# EasyEDA Pro project little_squeaky_machine.eprj, schematic Little Squeaky Machine

## Sheets
1 Processing: Board Name: Little_Squeaky_Machine_Hardware; Create Date: 2025-10-26; Page Name: Processing; Project Name: little_squeaky_machine; Schematic Name: Little Squeaky Machine; Update Date: 2025-10-26; Company: Hi Squeaky Things Lab; Drawn: Daniël; Page Size: A3; Reviewed: Daniël; Version: 0.1.0
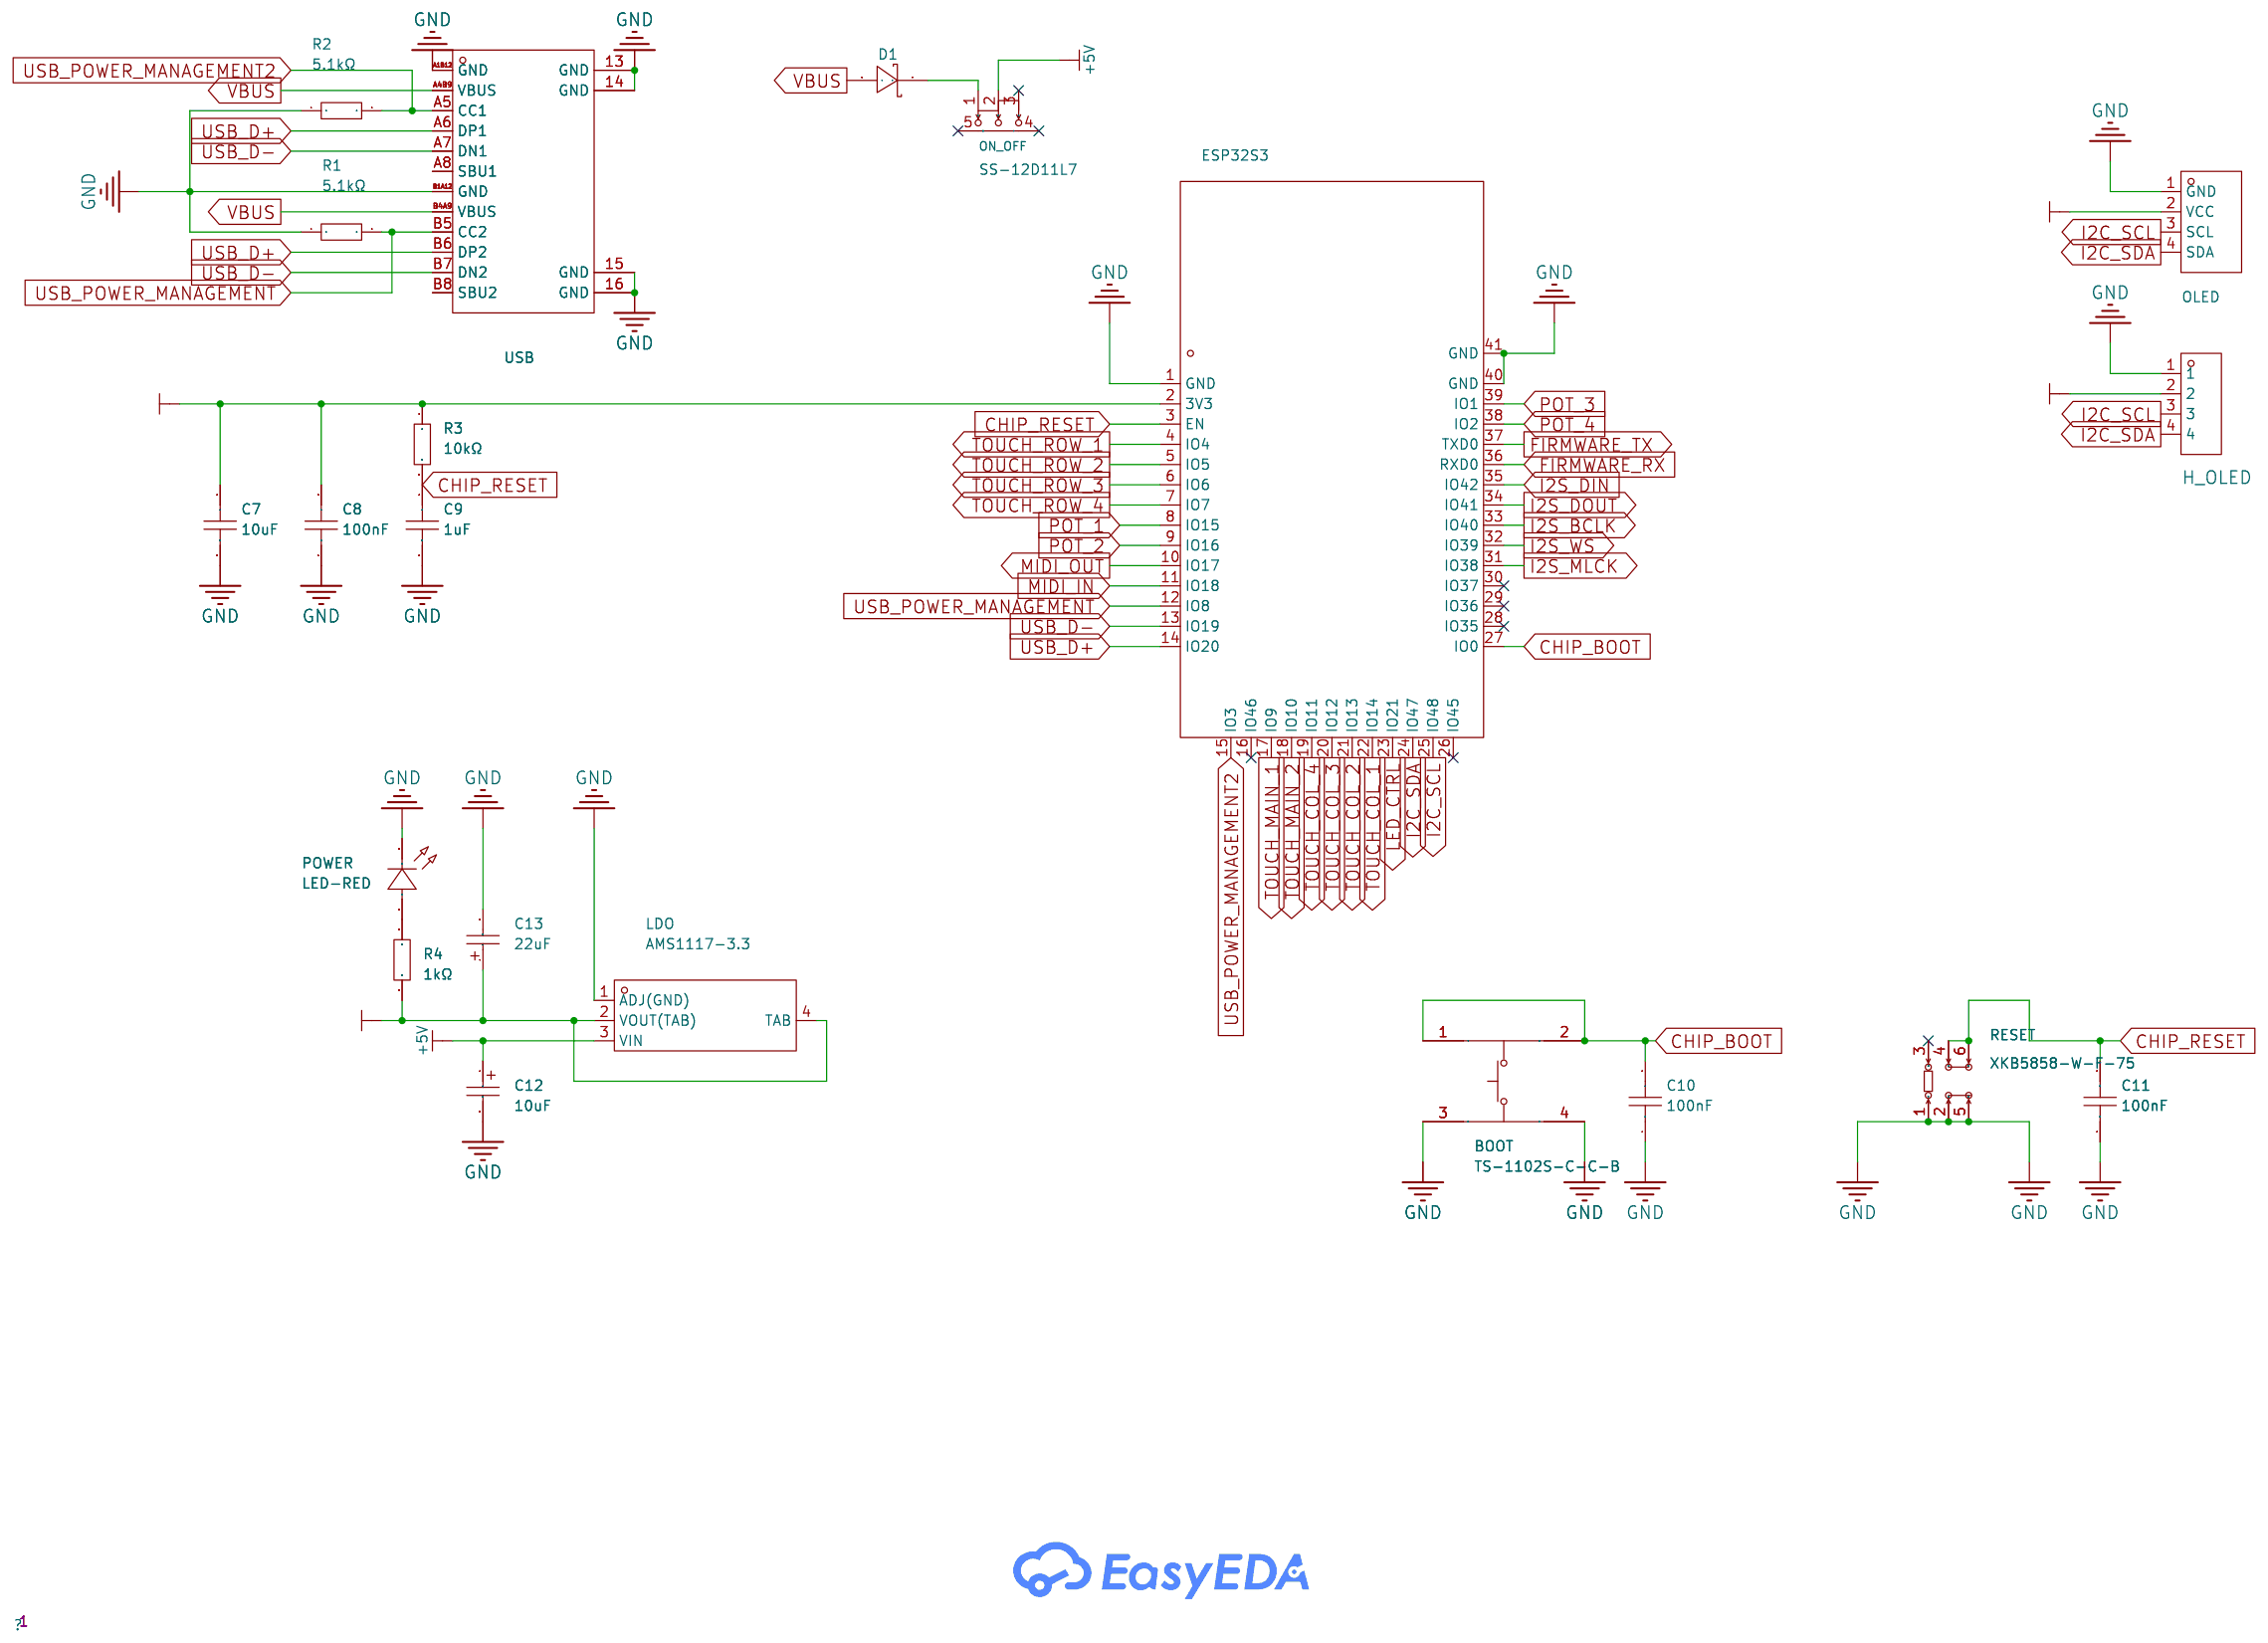
[diagram p0: Processing]
2 Audio Codec: Page Name: Audio Codec; Company: Hi Squeaky Things
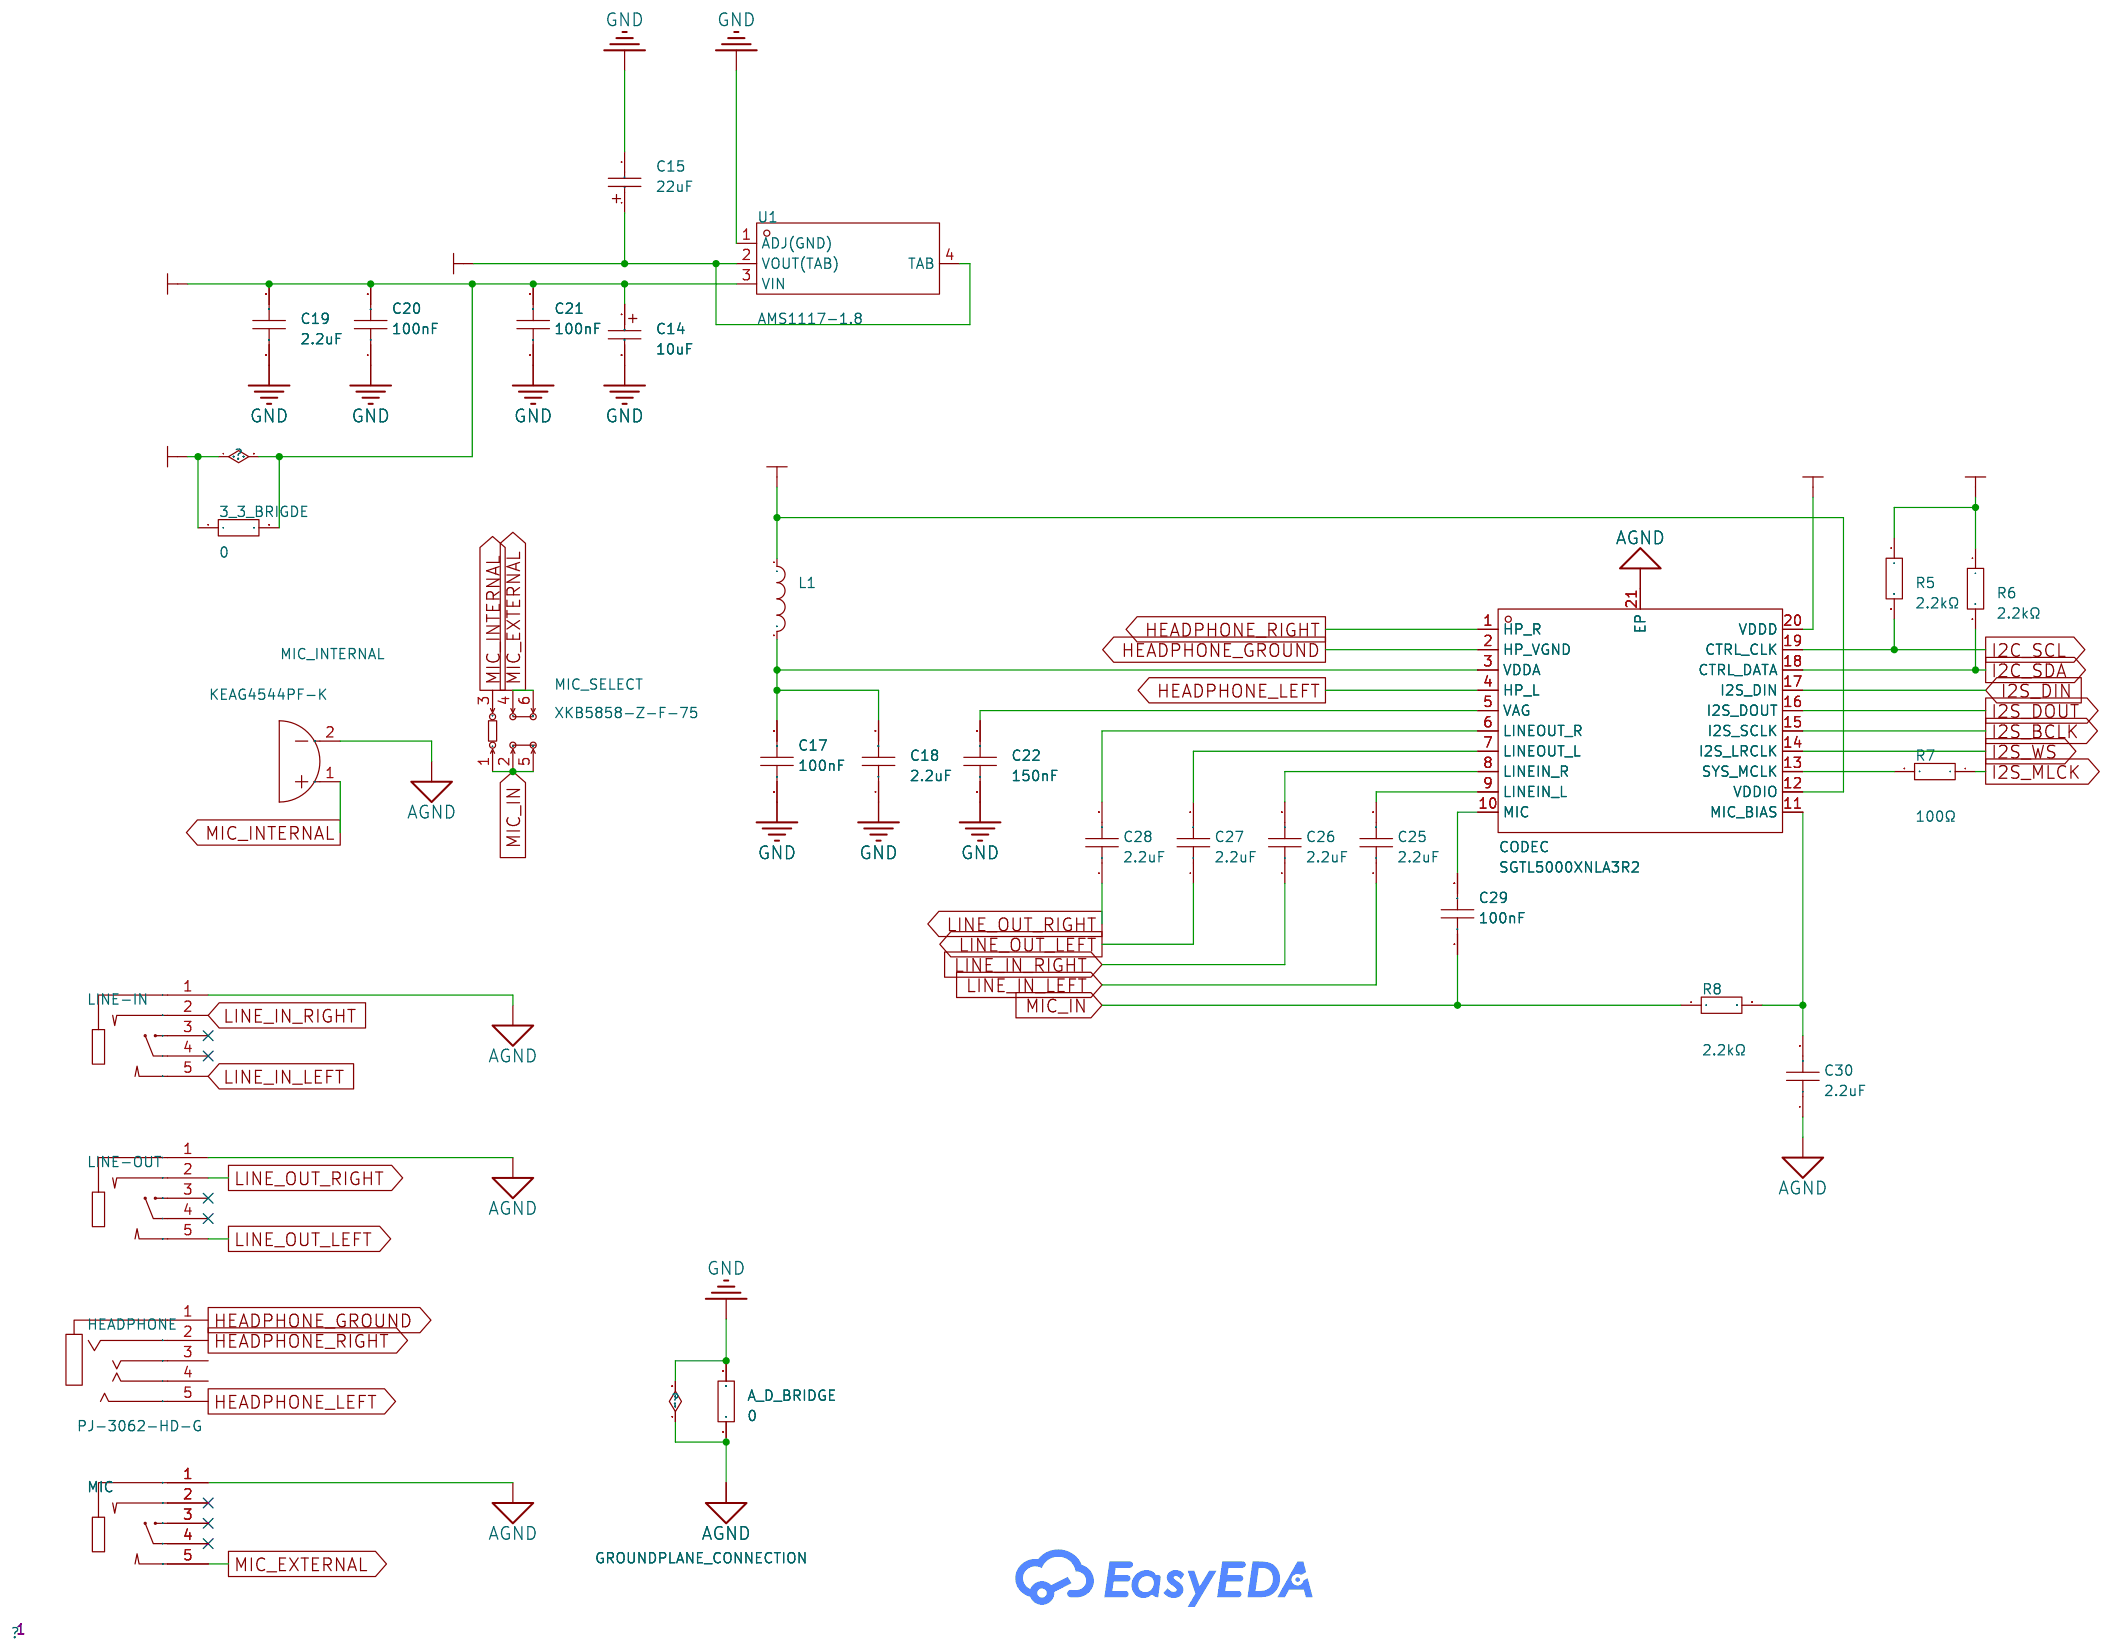
[diagram p1: Audio Codec]
3 Led Controls: Page Name: Led Controls; Company: Hi Squeaky Things; Drawn: Daniel; Page Size: A4
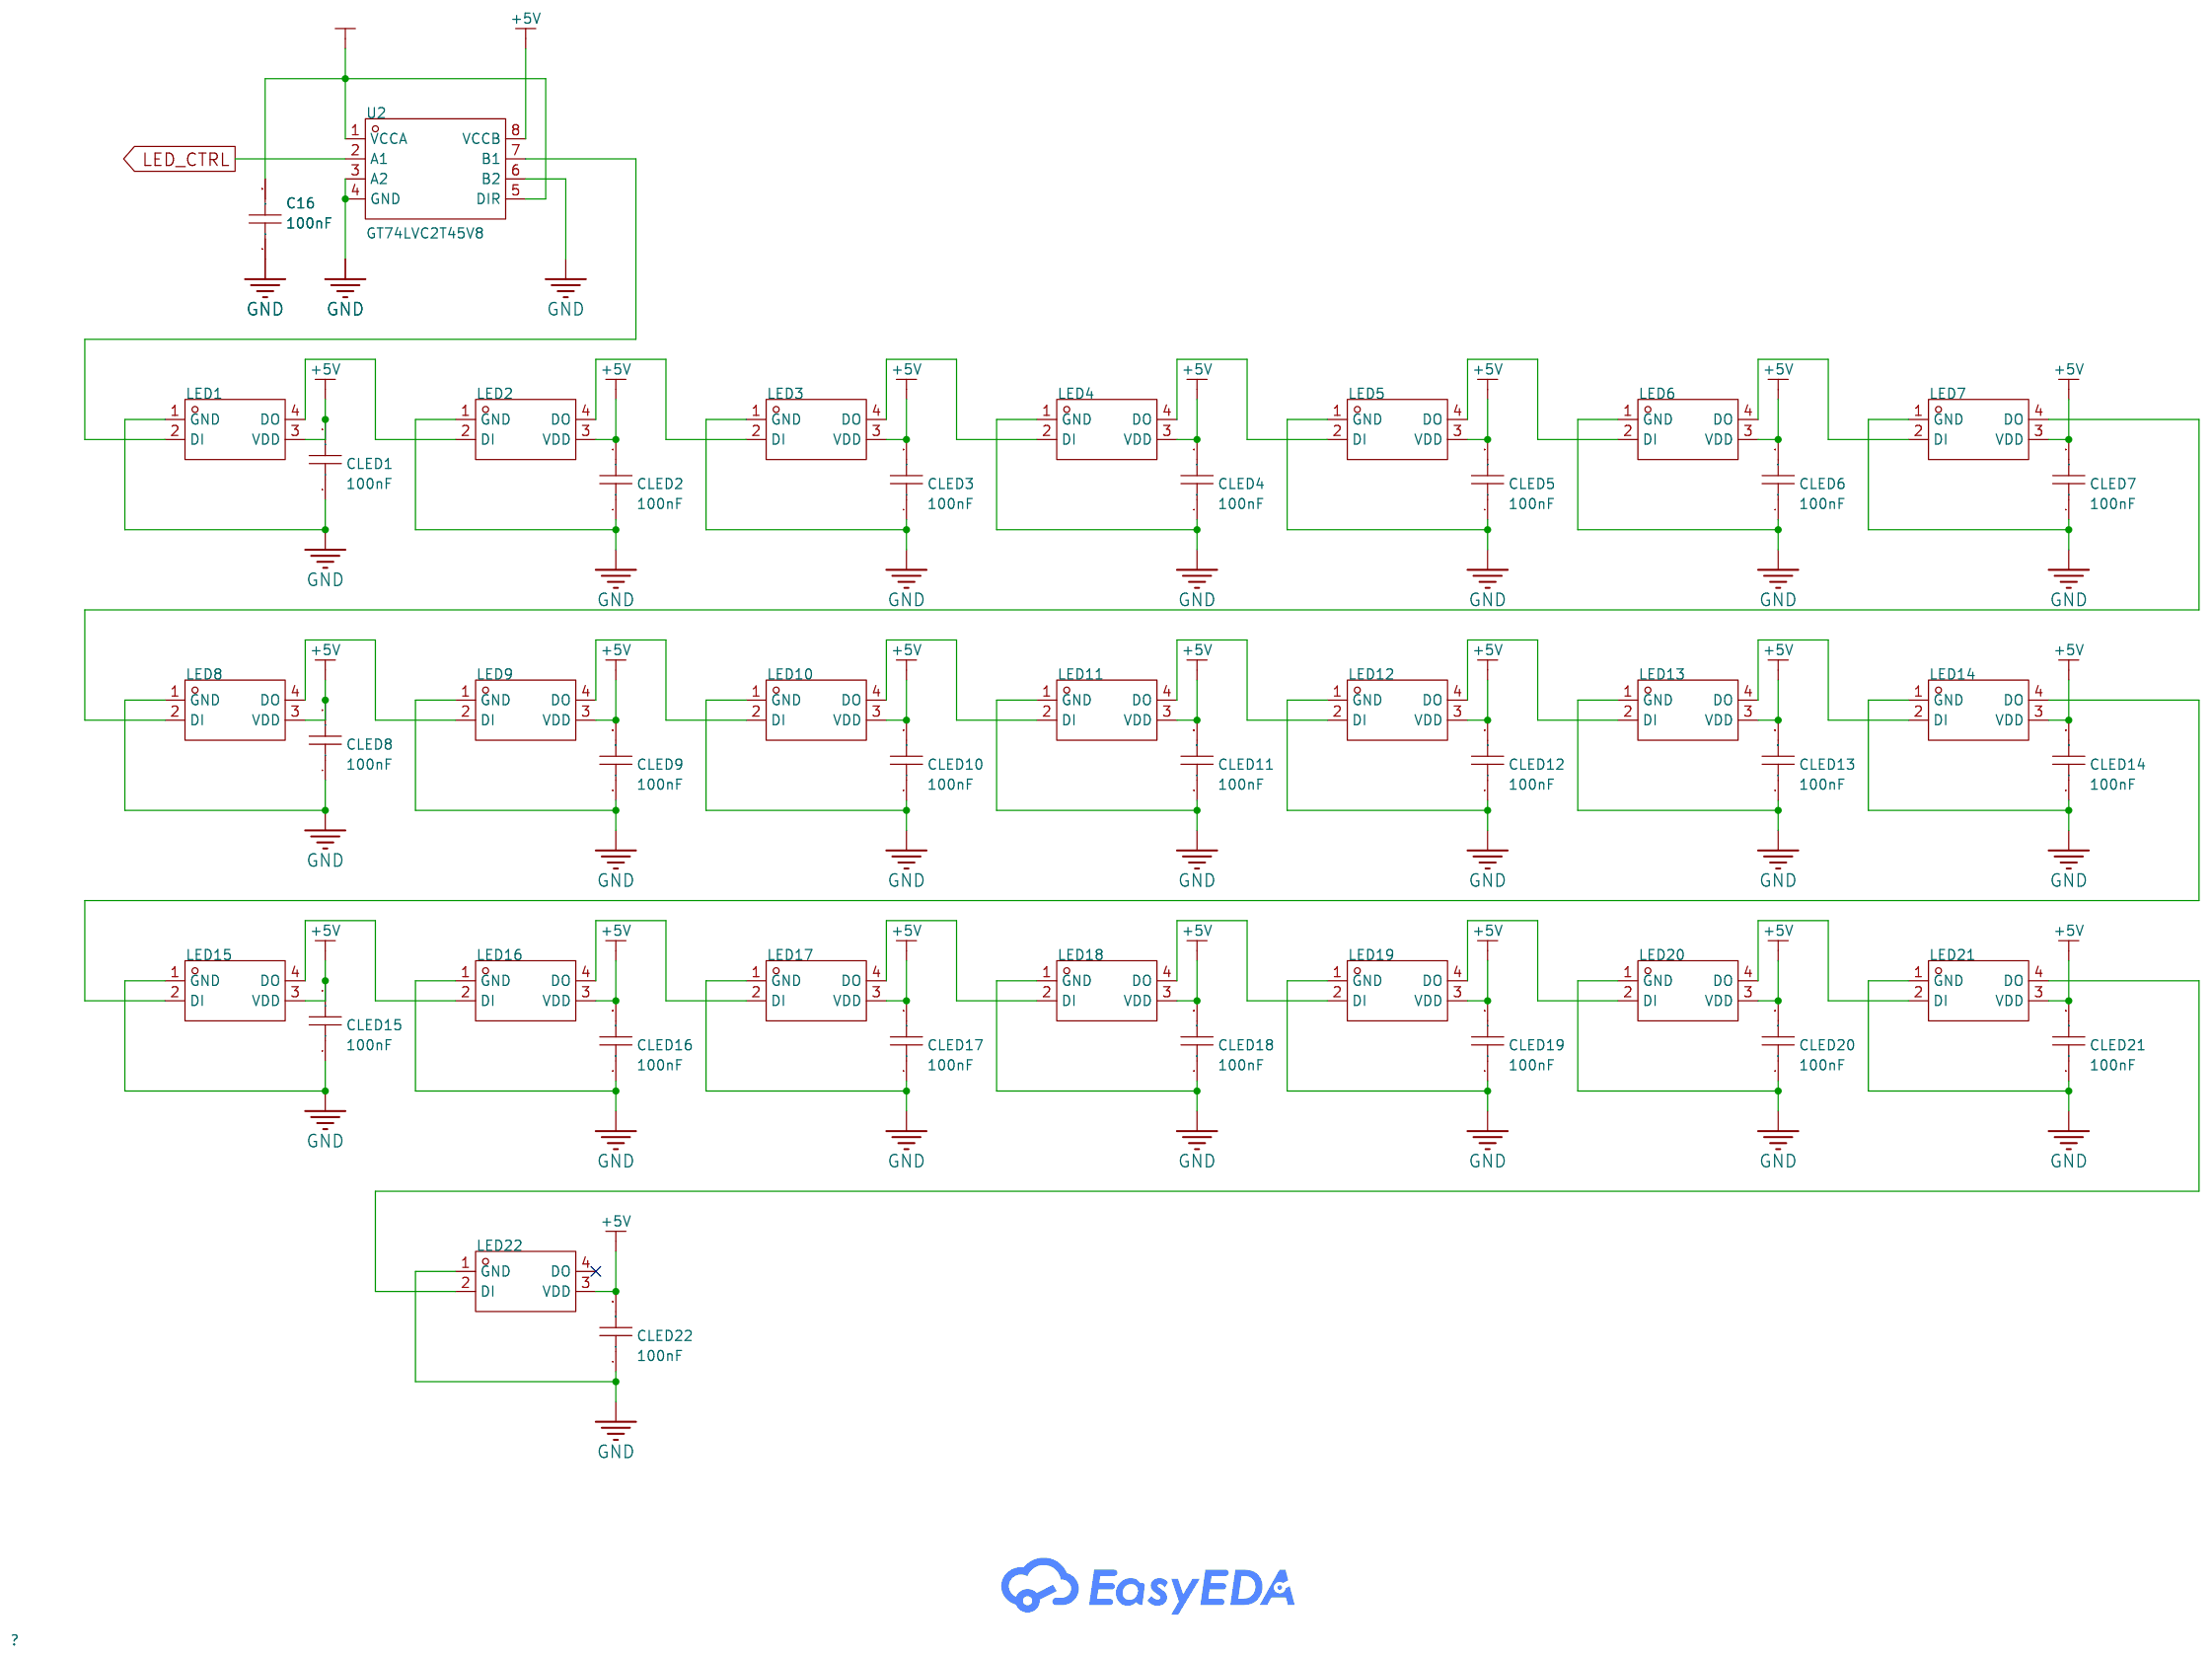
[diagram p2: Led Controls]
4 Pot and Encoder Controls: Page Name: Pot and Encoder Controls; Company: Hi Squeaky Things; Page Size: A4
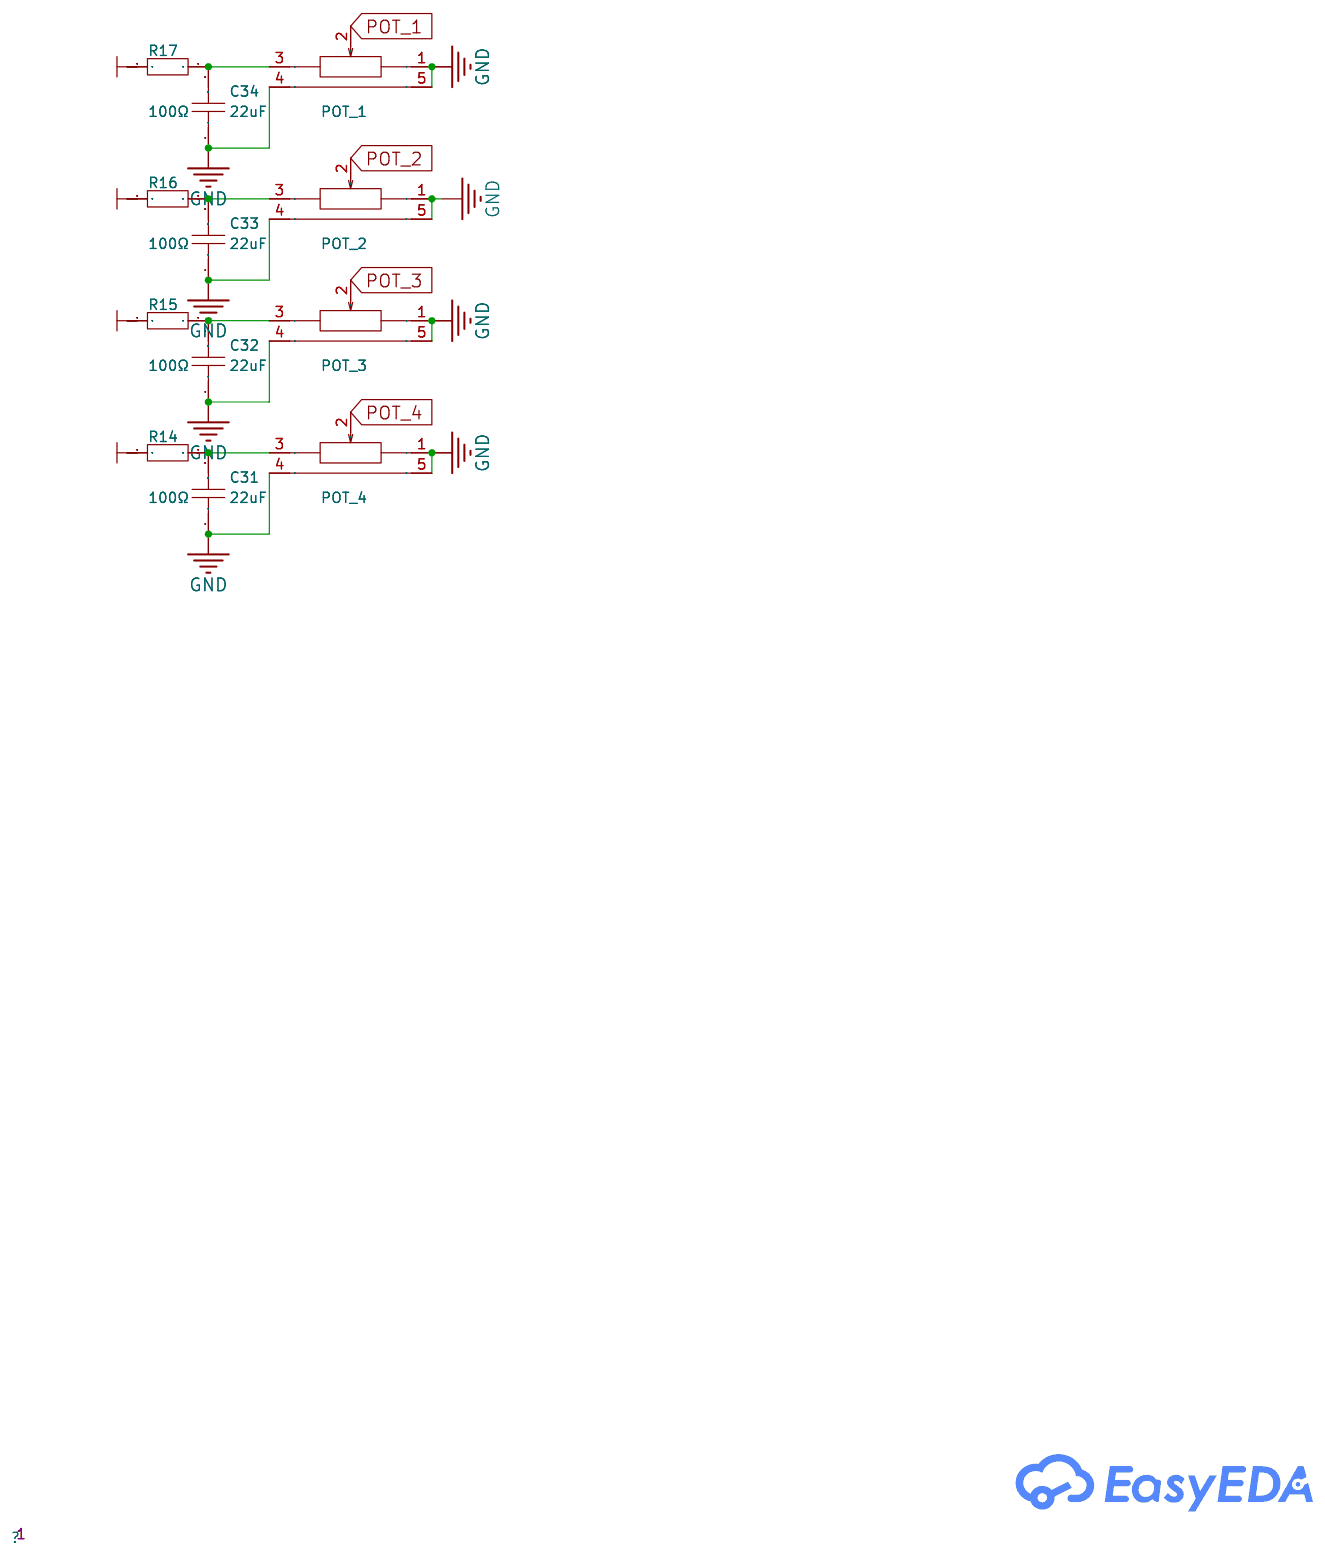
[diagram p3: Pot and Encoder Controls]

## Parts
sheet Audio Codec
3_3_BRIGDE  0  [R0603]  (no BOM)
A_D_BRIDGE  0  [R0603]  (no BOM)
C14  10uF  [CASE-A_3216]
C15  22uF  [CASE-A_3216]
C17  100nF  [C0402]
C18  2.2uF  [C0402]
C19  2.2uF  [C0402]
C20  100nF  [C0402]
C21  100nF  [C0402]
C22  150nF  [C0402]
C25  2.2uF  [C0402]
C26  2.2uF  [C0402]
C27  2.2uF  [C0402]
C28  2.2uF  [C0402]
C29  100nF  [C0402]
C30  2.2uF  [C0402]
CODEC  SGTL5000XNLA3R2  [QFN-20_L3.0-W3.0-P0.40-BL-EP1.7]
HEADPHONE  PJ-3062-HD-G  [AUDIO-TH_PJ-3062-HD-G]
L1  HCB2012KV-601T20  [L0805]
LINE-IN  PJ-3062-HD-B  [AUDIO-TH_PJ-3062-HD-B]
LINE-OUT  PJ-3062-HD-B  [AUDIO-TH_PJ-3062-HD-B]
MIC  PJ-3062-HD-R  [AUDIO-TH_XKB_PJ-3062-HD-R]
MIC_INTERNAL  KEAG4544PF-K  [MIC-TH_BD9.7-P2.50-D0.8-L-FD]
MIC_SELECT  XKB5858-Z-F-75  [SW-SMD_XKB5858-Z-F-75]
R5  2.2kΩ  [R0603]
R6  2.2kΩ  [R0603]
R7  100Ω  [R0603]
R8  2.2kΩ  [R0603]
U1  AMS1117-1.8  [SOT-223_L6.7-W3.5-P2.30-BR]
sheet Led Controls
C16  100nF  [C0402]
CLED1  100nF  [C0402]
CLED2  100nF  [C0402]
CLED3  100nF  [C0402]
CLED4  100nF  [C0402]
CLED5  100nF  [C0402]
CLED6  100nF  [C0402]
CLED7  100nF  [C0402]
CLED8  100nF  [C0402]
CLED9  100nF  [C0402]
CLED10  100nF  [C0402]
CLED11  100nF  [C0402]
CLED12  100nF  [C0402]
CLED13  100nF  [C0402]
CLED14  100nF  [C0402]
CLED15  100nF  [C0402]
CLED16  100nF  [C0402]
CLED17  100nF  [C0402]
CLED18  100nF  [C0402]
CLED19  100nF  [C0402]
CLED20  100nF  [C0402]
CLED21  100nF  [C0402]
CLED22  100nF  [C0402]
LED1  XL-2121RGBC-WS2812B  [LED-SMD_4P-L2.1-W2.1-BL]
LED2  XL-2121RGBC-WS2812B  [LED-SMD_4P-L2.1-W2.1-BL]
LED3  XL-2121RGBC-WS2812B  [LED-SMD_4P-L2.1-W2.1-BL]
LED4  XL-2121RGBC-WS2812B  [LED-SMD_4P-L2.1-W2.1-BL]
LED5  XL-2121RGBC-WS2812B  [LED-SMD_4P-L2.1-W2.1-BL]
LED6  XL-2121RGBC-WS2812B  [LED-SMD_4P-L2.1-W2.1-BL]
LED7  XL-2121RGBC-WS2812B  [LED-SMD_4P-L2.1-W2.1-BL]
LED8  XL-2121RGBC-WS2812B  [LED-SMD_4P-L2.1-W2.1-BL]
LED9  XL-2121RGBC-WS2812B  [LED-SMD_4P-L2.1-W2.1-BL]
LED10  XL-2121RGBC-WS2812B  [LED-SMD_4P-L2.1-W2.1-BL]
LED11  XL-2121RGBC-WS2812B  [LED-SMD_4P-L2.1-W2.1-BL]
LED12  XL-2121RGBC-WS2812B  [LED-SMD_4P-L2.1-W2.1-BL]
LED13  XL-2121RGBC-WS2812B  [LED-SMD_4P-L2.1-W2.1-BL]
LED14  XL-2121RGBC-WS2812B  [LED-SMD_4P-L2.1-W2.1-BL]
LED15  XL-2121RGBC-WS2812B  [LED-SMD_4P-L2.1-W2.1-BL]
LED16  XL-2121RGBC-WS2812B  [LED-SMD_4P-L2.1-W2.1-BL]
LED17  XL-2121RGBC-WS2812B  [LED-SMD_4P-L2.1-W2.1-BL]
LED18  XL-2121RGBC-WS2812B  [LED-SMD_4P-L2.1-W2.1-BL]
LED19  XL-2121RGBC-WS2812B  [LED-SMD_4P-L2.1-W2.1-BL]
LED20  XL-2121RGBC-WS2812B  [LED-SMD_4P-L2.1-W2.1-BL]
LED21  XL-2121RGBC-WS2812B  [LED-SMD_4P-L2.1-W2.1-BL]
LED22  XL-2121RGBC-WS2812B  [LED-SMD_4P-L2.1-W2.1-BL]
U2  GT74LVC2T45V8  [VSSOP-8_L2.3-W2.0-P0.50-LS3.1-BL]
sheet Pot and Encoder Controls
C31  22uF  [C0402]
C32  22uF  [C0402]
C33  22uF  [C0402]
C34  22uF  [C0402]
POT_1  10kΩ  [RES-TH_RK09K1130AAU]
POT_2  10kΩ  [RES-TH_RK09K1130AAU]
POT_3  10kΩ  [RES-TH_RK09K1130AAU]
POT_4  10kΩ  [RES-TH_RK09K1130AAU]
R14  100Ω  [R0603]
R15  100Ω  [R0603]
R16  100Ω  [R0603]
R17  100Ω  [R0603]
sheet Processing
BOOT  TS-1102S-C-C-B  [KEY-SMD_4P-L6.0-W6.0-P4.50-LS8.6]
C7  10uF  [C0603]
C8  100nF  [C0402]
C9  1uF  [C0201]
C10  100nF  [C0402]
C11  100nF  [C0402]
C12  10uF  [CASE-A_3216]
C13  22uF  [CASE-A_3216]
D1  SS34  [SMA_L4.3-W2.6-LS5.2-RD]
ESP32S3  ESP32-S3-WROOM-1-N16R8  [WIRELM-SMD_ESP32-S3-WROOM-1]
H_OLED  B-2100S04P-C000  [HDR-TH_4P-P2.54-V-M]
LDO  AMS1117-3.3  [SOT-223-4_L6.5-W3.5-P2.30-LS7.0-BR]
OLED  HS96L03W2C03  [OLED-TH_L27.8-W27.2-P2.54_C9900033791]
ON_OFF  SS-12D11L7  [SW-TH_XKB_SS-12D11L7]
POWER  LED-RED  [D-L1.6-W0.8-RD]
R1  5.1kΩ  [R0603]
R2  5.1kΩ  [R0603]
R3  10kΩ  [R0402]
R4  1kΩ  [R0603]
RESET  XKB5858-W-F-75  [SW-SMD_XKB5858-W-F-75]
USB  TYPEC-304YSSW-ACP16  [USB-SMD_TYPEC-304YSSW-ACP16]

## Library data of the parts
3_3_BRIGDE A_D_BRIDGE = Res_0603: Supplier Footprint: 0603
C12 C14 = CA45-A010M106T: Capacitance: Tolerance:±20% Tolerance:±20% Rated Voltage: Equivalent Series Resistance(ESR):3Ω@100kHz Operating Temperature:-55℃~+125℃ Operating Temperature:-55℃~+125℃; LCSC Part Name: 10uF ±20% 10V; Supplier Part: C127946; Manufacturer: 湘怡中元/湘江; Supplier Footprint: CASE-A-3216; JLCPCB Part Class: Extended Part; Datasheet: https://atta.szlcsc.com/upload/public/pdf/source/20191009/C435293_78A410F3D73489DBEAC46056C4262F7A.pdf; Supplier: LCSC; Tolerance: ±20%; Equivalent Series Resistance(ESR): 3Ω@100kHz; Operating Temperature: -55℃~+125℃; Check: true
C13 C15 = CA45-A-10V-22uF-K: Capacitance: Tolerance:±10% Tolerance:±10% Rated Voltage: Equivalent Series Resistance(ESR):10Ω@100kHz Operating Temperature:-55℃~+125℃ Operating Temperature:-55℃~+125℃; LCSC Part Name: 22uF ±10% 10V; Supplier Part: C129272; Manufacturer: CEC(振华新云); Supplier Footprint: CASE-A-3216; JLCPCB Part Class: Extended Part; Datasheet: https://atta.szlcsc.com/upload/public/pdf/source/20170914/C129272_1505359928095968134.pdf; Supplier: LCSC; Tolerance: ±10%; Equivalent Series Resistance(ESR): 10Ω@100kHz; Operating Temperature: -55℃~+125℃; Check: true
C8 C10 C11 C16 C17 C20 C21 C29 CLED1-CLED22 = CL05B104KO5NNNC: Capacitance: Tolerance:±10% Tolerance:±10% Voltage Rated: Temperature Coefficient:; LCSC Part Name: 100nF ±10% 16V; Supplier Part: C1525; Manufacturer: SAMSUNG(三星); Supplier Footprint: 0402; JLCPCB Part Class: Basic Part; Datasheet: https://atta.szlcsc.com/upload/public/pdf/source/20160218/1457707763339.pdf; Supplier: LCSC; Tolerance: ±10%
C18 C19 C25-C28 C30 = CGA0402X5R225M6R3GT: Capacitance: Tolerance:±20% Tolerance:±20% Voltage Rated: Temperature Coefficient:; LCSC Part Name: 2.2uF ±20% 6.3V; Supplier Part: C7503516; Manufacturer: HRE(芯声); Supplier Footprint: 0402; JLCPCB Part Class: Extended Part; Supplier: LCSC; Tolerance: ±20%; Check: true
C22 = TCC0402X7R154K160AT: Capacitance:150nF Tolerance:±10% Tolerance:±10% Voltage Rated: Temperature Coefficient:; LCSC Part Name: 150nF ±10% 16V; Supplier Part: C7393865; Manufacturer: CCTC(三环); Supplier Footprint: 0402; JLCPCB Part Class: Extended Part; Datasheet: https://atta.szlcsc.com/upload/public/pdf/source/20230606/1C21CCC6A1C08E8C3D36DB4723A2CB7D.pdf; Supplier: LCSC; Tolerance: ±10%; Check: true
CODEC = SGTL5000XNLA3R2: Type:Codec Interface:SPI；I2C；I2S Supply Voltage:- Supply Voltage:- Operating Temperature:-40℃~+85℃ Operating Temperature:-40℃~+85℃; LCSC Part Name: 低功耗立体声编解码器带耳机放大器 SGTL5000; Supplier Part: C2651833; Manufacturer: NXP(恩智浦); Supplier Footprint: QFN-20-EP(3x3); JLCPCB Part Class: Extended Part; Datasheet: https://www.nxp.com.cn/docs/en/data-sheet/SGTL5000.pdf; Supplier: LCSC; Type: Codec; Interface: SPI；I2C；I2S; Operating Temperature: -40℃~+85℃; Check: true
HEADPHONE = PJ-3062-HD-G: Connector Type:3.5mm Headphone Jack Current Rating (Max):500mA Voltage Rating (Max):30V Operating Temperature Range:-20℃~+70℃ Operating Temperature Range:-20℃~+70℃; LCSC Part Name: 3.5mm耳机座 绿色; Supplier Part: C431042; Manufacturer: XKB Connection(中国星坤); Supplier Footprint: 插件; JLCPCB Part Class: Extended Part; Datasheet: https://atta.szlcsc.com/upload/public/pdf/source/20211011/B99FFD5F289995B7120B9F0E64D42649.pdf; Supplier: LCSC; Connector Type: 3.5mm Headphone Jack; Current Rating (Max): 500mA; Voltage Rating (Max): 30V; Operating Temperature Range: -20℃~+70℃
L1 = HCB2012KV-601T20: Impedance @ Frequency:600Ω Tolerance:±25% Tolerance:±25%; LCSC Part Name: 车载品-2mm*1.2mm-600?-±25%; Supplier Part: C5139902; Manufacturer: TAI-TECH(台庆); Supplier Footprint: 1.2x2mm; JLCPCB Part Class: Extended Part; Datasheet: https://atta.szlcsc.com/upload/public/pdf/source/20220826/DABADC95CDC6A536804A6AD1C60B0DD2.pdf; Supplier: LCSC; Impedance @ Frequency: 600Ω; Tolerance: ±25%
LINE-IN LINE-OUT = PJ-3062-HD-B: Connector Type:3.5mm耳机座 Current Rating (Max):500mA Voltage Rating (Max):30V Operating Temperature Range:-20℃~+70℃ Operating Temperature Range:-20℃~+70℃ Soldering Temperature(Max):235℃; LCSC Part Name: 3.5mm耳机座 黑色; Supplier Part: C692443; Manufacturer: XKB Connectivity(中国星坤); Supplier Footprint: 插件; JLCPCB Part Class: Extended Part; Datasheet: https://atta.szlcsc.com/upload/public/pdf/source/20211011/B99FFD5F289995B7120B9F0E64D42649.pdf; Supplier: LCSC; Connector Type: 3.5mm耳机座; Current Rating (Max): 500mA; Voltage Rating (Max): 30V; Operating Temperature Range: -20℃~+70℃; Soldering Temperature(Max): 235℃
MIC = PJ-3062-HD-R: Connector Type:3.5mm耳机座 Current Rating (Max):500mA Voltage Rating (Max):30V Operating Temperature Range:-20℃~+70℃ Operating Temperature Range:-20℃~+70℃ Soldering Temperature(Max):235℃; LCSC Part Name: 3.5mm耳机座 红色; Supplier Part: C668225; Manufacturer: XKB Connectivity(中国星坤); Supplier Footprint: 插件; JLCPCB Part Class: Extended Part; Datasheet: https://atta.szlcsc.com/upload/public/pdf/source/20211011/B99FFD5F289995B7120B9F0E64D42649.pdf; Supplier: LCSC; Connector Type: 3.5mm耳机座; Current Rating (Max): 500mA; Voltage Rating (Max): 30V; Operating Temperature Range: -20℃~+70℃; Soldering Temperature(Max): 235℃
MIC_INTERNAL = KEAG4544PF-K: Voltage - Supply:3V Voltage - Supply:3V Current - Supply:500uA Direction:Omni-directional Output Impedance:2.2kΩ S/N Ratio:60dB Sensitivity:-44dB@±3dB Diameter(φD):9.7mm Height:4.5mm Operating Temperature:-20℃~+70℃ Operating Temperature:-20℃~+70℃; LCSC Part Name: 全指向性麦克风,-44DB,3.0V; Supplier Part: C7430174; Manufacturer: KINGSTATE(志丰电子); Supplier Footprint: 插件,D=9.7mm; JLCPCB Part Class: Extended Part; Datasheet: https://atta.szlcsc.com/upload/public/pdf/source/20230721/F85D8F434902D33A6C9D6CB8E360EE1B.pdf; Supplier: LCSC; Voltage - Supply: 3V; Current - Supply: 500uA; Direction: Omni-directional; Output Impedance: 2.2kΩ; S/N Ratio: 60dB; Sensitivity: -44dB@±3dB; Diameter(φD): 9.7mm; Height: 4.5mm; Operating Temperature: -20℃~+70℃
MIC_SELECT = XKB5858-Z-F-75: Self Lock / No Lock:LATCHING Actuator Style:Square Plunger Mounting Style:卧贴 Contact Current:100mA Voltage Rating (AC):250V Voltage Rating (DC):30V Insulation Resistance:100MΩ Actuator/Cap Color:White With Lamp:不带 Pin Style:Gull Wing Operating Force:250gf; Supplier Part: C2884736; Manufacturer: XKB Connectivity(中国星坤); Supplier Footprint: SMD; JLCPCB Part Class: Extended Part; Datasheet: https://atta.szlcsc.com/upload/public/pdf/source/20211009/95E080F85F5DEC82C83DDC4BCC34F336.pdf; Supplier: LCSC; Self Lock / No Lock: LATCHING; Actuator Style: Square Plunger; Mounting Style: 卧贴; Contact Current: 100mA; Voltage Rating (AC): 250V; Voltage Rating (DC): 30V; Insulation Resistance: 100MΩ; Actuator/Cap Color: White; With Lamp: 不带; Pin Style: Gull Wing; Operating Force: 250gf; Operating Temperature: -15℃~+55℃; Mechanical Life: 10万次; Check: true
R5 R6 R8 = 0603WAF2201T5E_C4190: Type:Thick Film Resistors Resistance:2.2kΩ Tolerance:±1% Tolerance:±1% Power(Watts): Overload Voltage (Max): Temperature Coefficient:±100ppm/℃ Temperature Coefficient:±100ppm/℃ Operating Temperature Range:-55℃~+155℃ Operating Temperature Range:-55℃~+155℃; LCSC Part Name: 2.2kΩ ±1% 100mW 厚膜电阻; Supplier Part: C4190; Manufacturer: UNI-ROYAL(厚声); Manufacturer Part: 0603WAF2201T5E; Supplier Footprint: 0603; JLCPCB Part Class: Basic Part; Datasheet: https://atta.szlcsc.com/upload/public/pdf/source/20200306/C422600_1E6D84923E4A46A82E41ADD87F860B5C.pdf; Supplier: LCSC; Type: Thick Film Resistors; Tolerance: ±1%; Temperature Coefficient: ±100ppm/℃; Operating Temperature Range: -55℃~+155℃; Check: true
R7 R14-R17 = RC0603FR-07100RL: Type:Thick Film Resistors Resistance: Tolerance:±1% Tolerance:±1% Power(Watts): Overload Voltage (Max): Temperature Coefficient:±100ppm/℃ Temperature Coefficient:±100ppm/℃ Operating Temperature Range:-55℃~+155℃ Operating Temperature Range:-55℃~+155℃; LCSC Part Name: 厚膜电阻 100Ω ±1% 100mW; Supplier Part: C105588; Manufacturer: YAGEO(国巨); Supplier Footprint: 0603; JLCPCB Part Class: Extended Part; Datasheet: https://atta.szlcsc.com/upload/public/pdf/source/20180316/70C0E2BDAE7FCC62C531A5A58D202EE1.pdf; Supplier: LCSC; Type: Thick Film Resistors; Tolerance: ±1%; Temperature Coefficient: ±100ppm/℃; Operating Temperature Range: -55℃~+155℃; Check: true
U1 = AMS1117-1.8_C347220: Output Type:Fixed Maximum Input Voltage:18V Output Voltage:1.8V Output Voltage:1.8V Output Current:1A Power Supply Rejection Ratio (PSRR):60dB@(120Hz) Dropout Voltage:1.3V@(1A) standby current:- Noise:- Feature:Overcurrent Protection(OCP) Operating Temper; LCSC Part Name: 输出:1.8V 电流:1A 耐压:12V; Supplier Part: C347220; Manufacturer: UMW(友台半导体); Supplier Footprint: SOT-223; JLCPCB Part Class: Extended Part; Datasheet: https://atta.szlcsc.com/upload/public/pdf/source/20241218/BAF0263FA2E44BCD8AF41AA4FA04EFAA.pdf; Supplier: LCSC; Output Type: Fixed; Maximum Input Voltage: 18V; Output Voltage: 1.8V; Output Current: 1A; Power Supply Rejection Ratio (PSRR): 60dB@(120Hz); Dropout Voltage: 1.3V@(1A); Feature: Overcurrent Protection(OCP); Output Polarity: Positive electrode; Number of Outputs: 1; Check: true
LED1-LED22 = XL-2121RGBC-WS2812B: Wavelength:620nm~630nm；515nm~525nm；465nm~475nm Luminous Intensity:300mcd；750mcd；200mcd Lens Color:Translucent Fog Lens Installation method:Positive Stick Operating Temperature:-20℃~+85℃; LCSC Part Name: 幻彩透明; Supplier Part: C5349957; Manufacturer: XINGLIGHT(成兴光); Supplier Footprint: SMD-4P,2x2mm; JLCPCB Part Class: Extended Part; Datasheet: https://atta.szlcsc.com/upload/public/pdf/source/20240218/90C9DDF21D4A35ED5BA7BC94DA3F96C5.pdf; Supplier: LCSC; Wavelength: 620nm~630nm；515nm~525nm；465nm~475nm; Luminous Intensity: 300mcd；750mcd；200mcd; Lens Color: Translucent Fog Lens; Installation method: Positive Stick; Operating Temperature: -20℃~+85℃; Check: true
U2 = GT74LVC2T45V8: Input type:- output type:- Supply Voltage:- Supply Voltage:- Number of Elements:- Number of Bits per Element:- Channel Type:-; Supplier Part: C22356905; Manufacturer: GTIC(谷泰微); Supplier Footprint: VSSOP-8; JLCPCB Part Class: Extended Part; Datasheet: https://atta.szlcsc.com/upload/public/pdf/source/20240327/DE6958162A711F001014F8EB6D4E47C4.pdf; Supplier: LCSC; Check: true
C31-C34 = CGA0402X5R226M100GT: Capacitance:22uF Tolerance:±20% Tolerance:±20% Voltage Rated: Temperature Coefficient:; LCSC Part Name: 22uF ±20% 10V; Supplier Part: C6119813; Manufacturer: HRE(芯声); Supplier Footprint: 0402; JLCPCB Part Class: Extended Part; Supplier: LCSC; Tolerance: ±20%; Check: true
POT_1-POT_4 = RK09K1130A5R: Resistance: Tolerance:±20% Tolerance:±20%; LCSC Part Name: 10kΩ ±20%; Supplier Part: C209779; Manufacturer: ALPSALPINE(阿尔卑斯阿尔派); Supplier Footprint: 插件; JLCPCB Part Class: Extended Part; Datasheet: https://atta.szlcsc.com/upload/public/pdf/source/20180404/C209779_144B5EF41D1B8507FF4660D0445AF581.pdf; Supplier: LCSC; Tolerance: ±20%
BOOT = TS-1102S-C-C-B: Circuit:SPST Actuator Style:Round Button Operating Force:260gf Mounting Style:Brick nogging Switch Length:6mm Switch Width:6mm Switch Height:5mm Strike Gundam:不带 Contact Current:50mA Voltage Rating (DC):12V Insulation Resistance:- Actuator/Cap Color:Black; LCSC Part Name: 6*6*5mm 立贴 轻触开关; Supplier Part: C381039; Manufacturer: XKB Connectivity(中国星坤); Supplier Footprint: SMD; JLCPCB Part Class: Extended Part; Datasheet: https://atta.szlcsc.com/upload/public/pdf/source/20211011/2711A6933F86C308D94098377C07E7B1.pdf; Supplier: LCSC; Circuit: SPST; Actuator Style: Round Button; Operating Force: 260gf; Mounting Style: Brick nogging; Switch Length: 6mm; Switch Width: 6mm; Switch Height: 5mm; Strike Gundam: 不带; Contact Current: 50mA; Voltage Rating (DC): 12V; Actuator/Cap Color: Black; With Lamp: No; Mechanical Life: 30万次; Operating Temperature: -20℃~+70℃; Check: true
C7 = CGA0603X5R106K100JT: Capacitance:10000000pF Tolerance:±10% Tolerance:±10% Voltage Rated: Temperature Coefficient:; LCSC Part Name: 10uF ±10% 10V; Supplier Part: C6119842; Manufacturer: HRE(芯声); Supplier Footprint: 0603; JLCPCB Part Class: Extended Part; Supplier: LCSC; Tolerance: ±10%; Check: true
C9 = GRM033R61A105ME44D: Capacitance: Tolerance:±20% Tolerance:±20% Voltage Rated: Temperature Coefficient:; LCSC Part Name: 1uF ±20% 10V; Supplier Part: C76935; Manufacturer: muRata(村田); Supplier Footprint: 0201; JLCPCB Part Class: Extended Part; Datasheet: https://atta.szlcsc.com/upload/public/pdf/source/20190904/C426118_85E81C7C1F21FC87C5FB6D536E0847B4.pdf; Supplier: LCSC; Tolerance: ±20%; Check: true
D1 = SS34_C8678: Diode Configuration:Independent Type Forward Voltage (Vf@If):550mV@3A Reverse Voltage (Vr):40V Rectified Current:3A Reverse Leakage Current (Ir):500uA@40V; LCSC Part Name: 电压:40V 电流:3A; Supplier Part: C8678; Manufacturer: MDD(辰达半导体); Supplier Footprint: SMA(DO-214AC); JLCPCB Part Class: Basic Part; Datasheet: https://atta.szlcsc.com/upload/public/pdf/source/20240710/2118BB86FDDB2E0B294389AC1F3F65C8.pdf; Supplier: LCSC; Diode Configuration: Independent Type; Forward Voltage (Vf@If): 550mV@3A; Reverse Voltage (Vr): 40V; Rectified Current: 3A; Reverse Leakage Current (Ir): 500uA@40V; Check: true
ESP32S3 = ESP32-S3-WROOM-1-N16R8: Supplier: LCSC; Supplier Part: C2913202; Manufacturer: ESPRESSIF(乐鑫); JLCPCB Part Class: Extended Part; LCSC Part Name: 通用型Wi-Fi+低功耗蓝牙MCU模组; Supplier Footprint: SMD,18x25.5mm; Datasheet: https://atta.szlcsc.com/upload/public/pdf/source/20220705/4E799F39581577F766659887F738A439.pdf; Check: true
H_OLED = B-2100S04P-C000: Pin Structure:1x4P Pitch:2.54mm Row Spacing:- Circluar Pins/Square Pins:Square Pins Mounting Type:Straight Number of Rows:Plugin Number of Pins:4P Current Rating (Max):3A Voltage Rating (Max):- Length of Mating Pin:3.6mm Insulation Height:5mm Length of En; LCSC Part Name: 间距:2.54mm 1x4P 直插 方针; Supplier Part: C2902691; Manufacturer: Ckmtw(灿科盟); Supplier Footprint: 插件,P=2.54mm; JLCPCB Part Class: Extended Part; Datasheet: https://atta.szlcsc.com/upload/public/pdf/source/20211021/3357FA133737681A7A46A5BDD4998D56.pdf; Supplier: LCSC; Pin Structure: 1x4P; Pitch: 2.54mm; Circluar Pins/Square Pins: Square Pins; Mounting Type: Straight; Number of Rows: Plugin; Number of Pins: 4P; Current Rating (Max): 3A; Length of Mating Pin: 3.6mm; Insulation Height: 5mm; Length of End Connection Pin: 3mm; Operating Temperature Range: -40℃~+105℃; Color: Black; Check: true
LDO = AMS1117-3.3_C347222: Output Type:Fixed Maximum Input Voltage:12V Output Voltage:3.3V Output Voltage:3.3V Output Current:1A Power Supply Rejection Ratio (PSRR):60dB@(120Hz) Dropout Voltage:1.3V@(1A) standby current:- Noise:- Feature:Overcurrent Protection(OCP) Operating Temper; LCSC Part Name: 输出:3.3V 电流:1A 耐压:12V; Supplier Part: C347222; Manufacturer: UMW(友台半导体); Supplier Footprint: SOT-223; JLCPCB Part Class: Extended Part; Datasheet: https://atta.szlcsc.com/upload/public/pdf/source/20241218/BAF0263FA2E44BCD8AF41AA4FA04EFAA.pdf; Supplier: LCSC; Output Type: Fixed; Maximum Input Voltage: 12V; Output Voltage: 3.3V; Output Current: 1A; Power Supply Rejection Ratio (PSRR): 60dB@(120Hz); Dropout Voltage: 1.3V@(1A); Feature: Overcurrent Protection(OCP); Output Polarity: Positive electrode; Number of Outputs: 1; Check: true
OLED = HS96L03W2C03: Main Control Chip:SSD1315 Interface Type:I2C Size:0.96 Pixel Resolution:128x64 Operating Temperature:-40℃~+70℃ Operating Temperature:-40℃~+70℃; LCSC Part Name: 0.96寸OLED显示屏窄白光IIC; Supplier Part: C5248080; Manufacturer: HS(汉昇); JLCPCB Part Class: Extended Part; Datasheet: https://atta.szlcsc.com/upload/public/pdf/source/20230627/763D01F79A90007632F098068C7C8AD9.pdf; Supplier: LCSC; Main Control Chip: SSD1315; Interface Type: I2C; Size: 0.96; Pixel Resolution: 128x64; Operating Temperature: -40℃~+70℃; Check: true
ON_OFF = SS-12D11L7: Circuit:SPDT Actuator Style:Rectangular columnar Pin Style:PCPin Switch Length:13.5mm Switch Width:6.6mm Switch Height:6.3mm Mounting Style:Right-Angle Actuator Color:Black Current Rating (DC):3A Voltage Rating (DC):125V Current Rating (AC):3A Voltage Rat; LCSC Part Name: 柄长7mm 弯插双档 滑动开关; Supplier Part: C2884775; Manufacturer: XKB Connectivity(中国星坤); Supplier Footprint: 插件; JLCPCB Part Class: Extended Part; Datasheet: https://atta.szlcsc.com/upload/public/pdf/source/20211009/84F89DEF741E27E9E55DE4039DC07CAD.pdf; Supplier: LCSC; Circuit: SPDT; Actuator Style: Rectangular columnar; Pin Style: PCPin; Switch Length: 13.5mm; Switch Width: 6.6mm; Switch Height: 6.3mm; Mounting Style: Right-Angle; Actuator Color: Black; Current Rating (DC): 3A; Voltage Rating (DC): 125V; Current Rating (AC): 3A; Voltage Rating (AC): 125V; Mechanical Life: 1万次; Operating Temperature: -40℃~+85℃; Check: true
POWER = F.0603.00025/P2-0603G1TS2-06T-002: Emitted Color:Emerald Forward Voltage (VF):2.6V~2.9V Forward Voltage (VF):2.6V~2.9V Forward Current:- Dominant Wavelength:520nm~525nm Dominant Wavelength:520nm~525nm Lens Color:- Luminous Intensity:230mcd Luminous Intensity:230mcd Viewing Angle:120° Opera; Supplier Part: C7496818; Manufacturer: TUOZHAN(拓展光电); Supplier Footprint: 0603; JLCPCB Part Class: Extended Part; Datasheet: https://atta.szlcsc.com/upload/public/pdf/source/20230809/EA2F9723ADA317BF34481AEADE85B597.pdf; Supplier: LCSC; Emitted Color: Emerald; Forward Voltage (VF): 2.6V~2.9V; Dominant Wavelength: 520nm~525nm; Luminous Intensity: 230mcd; Viewing Angle: 120°; Operating Temperature: -40℃~+85℃; Check: true
R1 R2 = 0603WAF5101T5E: Type:Thick Film Resistors Resistance:5.1kΩ Tolerance:±1% Tolerance:±1% Power(Watts): Overload Voltage (Max): Temperature Coefficient:±100ppm/℃ Temperature Coefficient:±100ppm/℃ Operating Temperature Range:-55℃~+155℃ Operating Temperature Range:-55℃~+155℃; LCSC Part Name: 5.1kΩ ±1% 100mW 厚膜电阻; Supplier Part: C23186; Manufacturer: UNI-ROYAL(厚声); Supplier Footprint: 0603; JLCPCB Part Class: Basic Part; Datasheet: https://atta.szlcsc.com/upload/public/pdf/source/20200306/C422600_1E6D84923E4A46A82E41ADD87F860B5C.pdf; Supplier: LCSC; Type: Thick Film Resistors; Tolerance: ±1%; Temperature Coefficient: ±100ppm/℃; Operating Temperature Range: -55℃~+155℃; Check: true
R3 = SCR0402J10K: Type:Thick Film Resistors Resistance: Tolerance:±5% Tolerance:±5% Power(Watts): Overload Voltage (Max): Operating Temperature Range:-55℃~+155℃ Operating Temperature Range:-55℃~+155℃; LCSC Part Name: 厚膜电阻 10kΩ ±5% 62.5mW; Supplier Part: C3017497; Manufacturer: VO(翔胜); Supplier Footprint: 0402; JLCPCB Part Class: Extended Part; Datasheet: https://atta.szlcsc.com/upload/public/pdf/source/20220513/247AF9639BA21CF93567DC289CCC6A22.pdf; Supplier: LCSC; Type: Thick Film Resistors; Tolerance: ±5%; Operating Temperature Range: -55℃~+155℃; Check: true
R4 = FRC0603J102 TS: Type:Thick Film Resistors Resistance:1kΩ Tolerance:±5% Tolerance:±5% Power(Watts): Overload Voltage (Max): Temperature Coefficient:±100ppm/℃ Temperature Coefficient:±100ppm/℃ Operating Temperature Range:-55℃~+155℃ Operating Temperature Range:-55℃~+155℃; LCSC Part Name: 1kΩ ±5% 100mW 厚膜电阻; Supplier Part: C2907113; Manufacturer: FOJAN(富捷); Supplier Footprint: 0603; JLCPCB Part Class: Extended Part; Datasheet: https://atta.szlcsc.com/upload/public/pdf/source/20211221/925EC7D7225764EE0046F22065062C87.pdf; Supplier: LCSC; Type: Thick Film Resistors; Tolerance: ±5%; Temperature Coefficient: ±100ppm/℃; Operating Temperature Range: -55℃~+155℃; Check: true
RESET = XKB5858-W-F-75: Self Lock / No Lock:No lock Actuator Style:Square Plunger Mounting Style:Horizontal attachment Contact Current:100mA Voltage Rating (AC):250V Voltage Rating (DC):30V Insulation Resistance:100MΩ Actuator/Cap Color:White With Lamp:Without Pin Style:Gullwing; Supplier Part: C780037; Manufacturer: XKB Connection(中国星坤); Supplier Footprint: SMD; JLCPCB Part Class: Extended Part; Datasheet: https://atta.szlcsc.com/upload/public/pdf/source/20211009/95E080F85F5DEC82C83DDC4BCC34F336.pdf; Supplier: LCSC; Self Lock / No Lock: No lock; Actuator Style: Square Plunger; Mounting Style: Horizontal attachment; Contact Current: 100mA; Voltage Rating (AC): 250V; Voltage Rating (DC): 30V; Insulation Resistance: 100MΩ; Actuator/Cap Color: White; With Lamp: Without; Pin Style: Gullwing; Operating Force: 250gf; Operating Temperature: -15℃~+55℃; Mechanical Life: 100000 Times; Check: true
USB = TYPEC-304YSSW-ACP16: Connector Type:Type-C Standard:USB 3.1 Gender:Female Number of Ports:1 Number of Contacts:16P Mounting Style:卧贴 Current Rating - Power (Max):5A Contact Material:- Contact Plating:- Operating Temperature Range:-25℃~+85℃ Operating Temperature Range:-25℃~+85; LCSC Part Name: Type-C 母 卧贴; Supplier Part: C2840392; Manufacturer: XUNPU(讯普); Supplier Footprint: SMD; JLCPCB Part Class: Extended Part; Datasheet: https://atta.szlcsc.com/upload/public/pdf/source/20210615/C2840392_E4D6700BD82FA37F52F4054C59437243.pdf; Supplier: LCSC; Connector Type: Type-C; Standard: USB 3.1; Gender: Female; Number of Ports: 1; Number of Contacts: 16P; Mounting Style: 卧贴; Current Rating - Power (Max): 5A; Operating Temperature Range: -25℃~+85℃; Soldering Temperature(Max): 260℃

## Nets
+1.8V: C15.1 CODEC.20(VDDD) U1.2(VOUT(TAB)) U1.4(TAB)
+3.3V: 3_3_BRIGDE.1 3_3_BRIGDE.2 C7.1 C8.2 C13.1 C14.1 C16.2 C19.2 C20.2 C21.2 CODEC.12(VDDIO) ESP32S3.2(3V3) H_OLED.2 L1.1 LDO.2(VOUT(TAB)) LDO.4(TAB) OLED.2(VCC) R3.1 R4.1 R5.1 R6.1 R14.2 R15.2 R16.2 R17.2 U1.3(VIN) U2.1(VCCA) U2.5(DIR)
+5V: C12.1 CLED1.2 CLED2.2 CLED3.2 CLED4.2 CLED5.2 CLED6.2 CLED7.2 CLED8.2 CLED9.2 CLED10.2 CLED11.2 CLED12.2 CLED13.2 CLED14.2 CLED15.2 CLED16.2 CLED17.2 CLED18.2 CLED19.2 CLED20.2 CLED21.2 CLED22.2 LDO.3(VIN) LED1.3(VDD) LED2.3(VDD) LED3.3(VDD) LED4.3(VDD) LED5.3(VDD) LED6.3(VDD) LED7.3(VDD) LED8.3(VDD) LED9.3(VDD) LED10.3(VDD) LED11.3(VDD) LED12.3(VDD) LED13.3(VDD) LED14.3(VDD) LED15.3(VDD) LED16.3(VDD) LED17.3(VDD) LED18.3(VDD) LED19.3(VDD) LED20.3(VDD) LED21.3(VDD) LED22.3(VDD) ON_OFF.2 U2.8(VCCB)
AGND: A_D_BRIDGE.1 A_D_BRIDGE.2 BOOT.3 BOOT.4 C7.2 C8.1 C9.2 C10.1 C11.1 C12.2 C13.2 C14.2 C15.2 C16.1 C17.1 C18.1 C19.1 C20.1 C21.1 C22.1 C30.1 C31.1 C32.1 C33.1 C34.1 CLED1.1 CLED2.1 CLED3.1 CLED4.1 CLED5.1 CLED6.1 CLED7.1 CLED8.1 CLED9.1 CLED10.1 CLED11.1 CLED12.1 CLED13.1 CLED14.1 CLED15.1 CLED16.1 CLED17.1 CLED18.1 CLED19.1 CLED20.1 CLED21.1 CLED22.1 CODEC.21(EP) ESP32S3.1(GND) ESP32S3.40(GND) ESP32S3.41(GND) H_OLED.1 LDO.1(ADJ(GND)) LED1.1(GND) LED2.1(GND) LED3.1(GND) LED4.1(GND) LED5.1(GND) LED6.1(GND) LED7.1(GND) LED8.1(GND) LED9.1(GND) LED10.1(GND) LED11.1(GND) LED12.1(GND) LED13.1(GND) LED14.1(GND) LED15.1(GND) LED16.1(GND) LED17.1(GND) LED18.1(GND) LED19.1(GND) LED20.1(GND) LED21.1(GND) LED22.1(GND) LINE-IN.1 LINE-OUT.1 MIC.1 MIC_INTERNAL.2 OLED.1(GND) POT_1.1 POT_1.4(EH) POT_1.5(EH) POT_2.1 POT_2.4(EH) POT_2.5(EH) POT_3.1 POT_3.4(EH) POT_3.5(EH) POT_4.1 POT_4.4(EH) POT_4.5(EH) POWER.1(K) R1.1 R2.1 RESET.1 RESET.2 RESET.5 U1.1(ADJ(GND)) U2.3(A2) U2.4(GND) U2.6(B2) USB.13(GND) USB.14(GND) USB.15(GND) USB.16(GND) USB.A1B12(GND) USB.B1A12(GND)
VBUS: D1.2(A) USB.A4B9(VBUS) USB.B4A9(VBUS)
CHIP_BOOT: BOOT.1 BOOT.2 C10.2 ESP32S3.27(IO0)
CHIP_RESET: C9.1 C11.2 ESP32S3.3(EN) R3.2 RESET.4 RESET.6
FIRMWARE_RX: ESP32S3.36(RXD0)
FIRMWARE_TX: ESP32S3.37(TXD0)
HEADPHONE_GROUND: CODEC.2(HP_VGND) HEADPHONE.1
HEADPHONE_LEFT: CODEC.4(HP_L) HEADPHONE.5
HEADPHONE_RIGHT: CODEC.1(HP_R) HEADPHONE.2
I2C_SCL: CODEC.19(CTRL_CLK) ESP32S3.25(IO48) H_OLED.3 OLED.3(SCL) R5.2
I2C_SDA: CODEC.18(CTRL_DATA) ESP32S3.24(IO47) H_OLED.4 OLED.4(SDA) R6.2
I2S_BCLK: CODEC.15(I2S_SCLK) ESP32S3.33(IO40)
I2S_DIN: CODEC.17(I2S_DIN) ESP32S3.35(IO42)
I2S_DOUT: CODEC.16(I2S_DOUT) ESP32S3.34(IO41)
I2S_MLCK: ESP32S3.31(IO38) R7.1
I2S_WS: CODEC.14(I2S_LRCLK) ESP32S3.32(IO39)
LED_CTRL: ESP32S3.23(IO21) U2.2(A1)
LINE_IN_LEFT: C25.1 LINE-IN.5
LINE_IN_RIGHT: C26.1 LINE-IN.2
LINE_OUT_LEFT: C27.1 LINE-OUT.5
LINE_OUT_RIGHT: C28.1 LINE-OUT.2
MIC_EXTERNAL: MIC.5 MIC_SELECT.4 MIC_SELECT.6
MIC_IN: C29.1 MIC_SELECT.1 MIC_SELECT.2 MIC_SELECT.5 R8.1
MIC_INTERNAL: MIC_INTERNAL.1 MIC_SELECT.3
MIDI_IN: ESP32S3.11(IO18)
MIDI_OUT: ESP32S3.10(IO17)
POT_1: ESP32S3.8(IO15) POT_1.2
POT_2: ESP32S3.9(IO16) POT_2.2
POT_3: ESP32S3.39(IO1) POT_3.2
POT_4: ESP32S3.38(IO2) POT_4.2
TOUCH_COL_1: ESP32S3.22(IO14)
TOUCH_COL_2: ESP32S3.21(IO13)
TOUCH_COL_3: ESP32S3.20(IO12)
TOUCH_COL_4: ESP32S3.19(IO11)
TOUCH_MAIN_1: ESP32S3.17(IO9)
TOUCH_MAIN_2: ESP32S3.18(IO10)
TOUCH_ROW_1: ESP32S3.4(IO4)
TOUCH_ROW_2: ESP32S3.5(IO5)
TOUCH_ROW_3: ESP32S3.6(IO6)
TOUCH_ROW_4: ESP32S3.7(IO7)
USB_D+: ESP32S3.14(IO20) USB.A6(DP1) USB.B6(DP2)
USB_D-: ESP32S3.13(IO19) USB.A7(DN1) USB.B7(DN2)
USB_POWER_MANAGEMENT: ESP32S3.12(IO8) R1.2 USB.B5(CC2)
USB_POWER_MANAGEMENT2: ESP32S3.15(IO3) R2.2 USB.A5(CC1)
$1N3148: POWER.2(A) R4.2
$1N7009: D1.1(K) ON_OFF.1
$2N6260: CODEC.13(SYS_MCLK) R7.2
$2N10513: C17.2 C18.2 CODEC.3(VDDA) L1.2
$2N11857: C22.2 CODEC.5(VAG)
$2N12488: C28.2 CODEC.6(LINEOUT_R)
$2N12493: C27.2 CODEC.7(LINEOUT_L)
$2N12499: C26.2 CODEC.8(LINEIN_R)
$2N12505: C25.2 CODEC.9(LINEIN_L)
$2N12879: C29.2 CODEC.10(MIC)
$2N12925: C30.2 CODEC.11(MIC_BIAS) R8.2
$3N2922: LED1.2(DI) U2.7(B1)
$3N5101: LED1.4(DO) LED2.2(DI)
$3N5214: LED2.4(DO) LED3.2(DI)
$3N5662: LED3.4(DO) LED4.2(DI)
$3N5779: LED4.4(DO) LED5.2(DI)
$3N6015: LED5.4(DO) LED6.2(DI)
$3N6132: LED6.4(DO) LED7.2(DI)
$3N7352: LED13.4(DO) LED14.2(DI)
$3N7353: LED12.4(DO) LED13.2(DI)
$3N7358: LED10.4(DO) LED11.2(DI)
$3N7360: LED11.4(DO) LED12.2(DI)
$3N7361: LED7.4(DO) LED8.2(DI)
$3N7363: LED9.4(DO) LED10.2(DI)
$3N7367: LED8.4(DO) LED9.2(DI)
$3N8110: LED20.4(DO) LED21.2(DI)
$3N8111: LED19.4(DO) LED20.2(DI)
$3N8116: LED17.4(DO) LED18.2(DI)
$3N8118: LED18.4(DO) LED19.2(DI)
$3N8119: LED14.4(DO) LED15.2(DI)
$3N8121: LED16.4(DO) LED17.2(DI)
$3N8125: LED15.4(DO) LED16.2(DI)
$3N8263: LED21.4(DO) LED22.2(DI)
$5N1901: C31.2 POT_4.3 R14.1
$5N2026: C32.2 POT_3.3 R15.1
$5N2131: C33.2 POT_2.3 R16.1
$5N2225: C34.2 POT_1.3 R17.1

Not connected (* = marked no-connect by the designer): ESP32S3 16(IO46)* 26(IO45)* 28(IO35)* 29(IO36)* 30(IO37)*; HEADPHONE 3 4; LED22 4(DO)*; LINE-IN 3* 4*; LINE-OUT 3* 4*; MIC 2* 3* 4*; ON_OFF 3* 4* 5*; RESET 3*; USB A8(SBU1) B8(SBU2)
